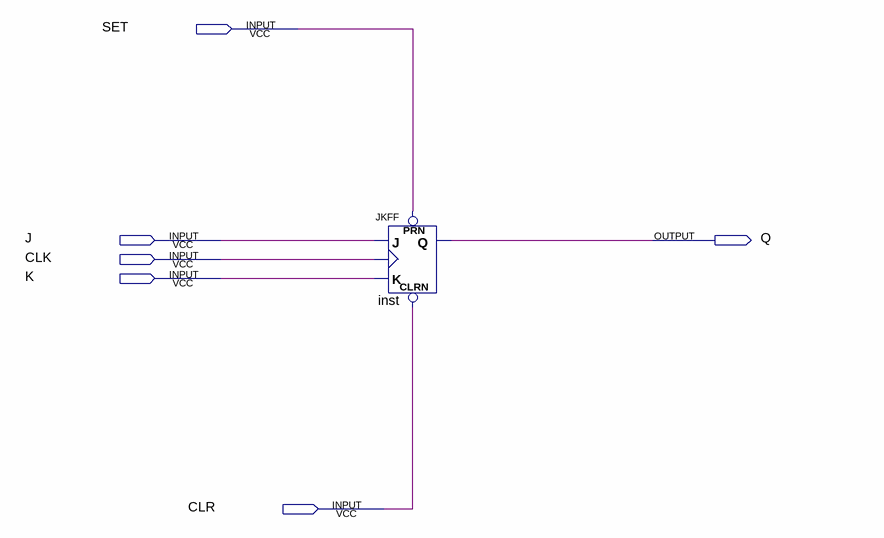
[diagram p0: schematic sheet]
// Quartus schematic JKFlipFlop.bdf as structural Verilog: 1 symbols, 6 pins
module JKFlipFlop (
  input  SET,
  input  J,
  input  CLK,
  input  K,
  input  CLR,
  output Q
);

  JKFF inst (.PRN(SET), .CLRN(CLR), .K(K), .J(J), .CLK(CLK), .Q(Q));
endmodule
